# EAGLE design rpi0smiLS (EAGLE 9.3.2)
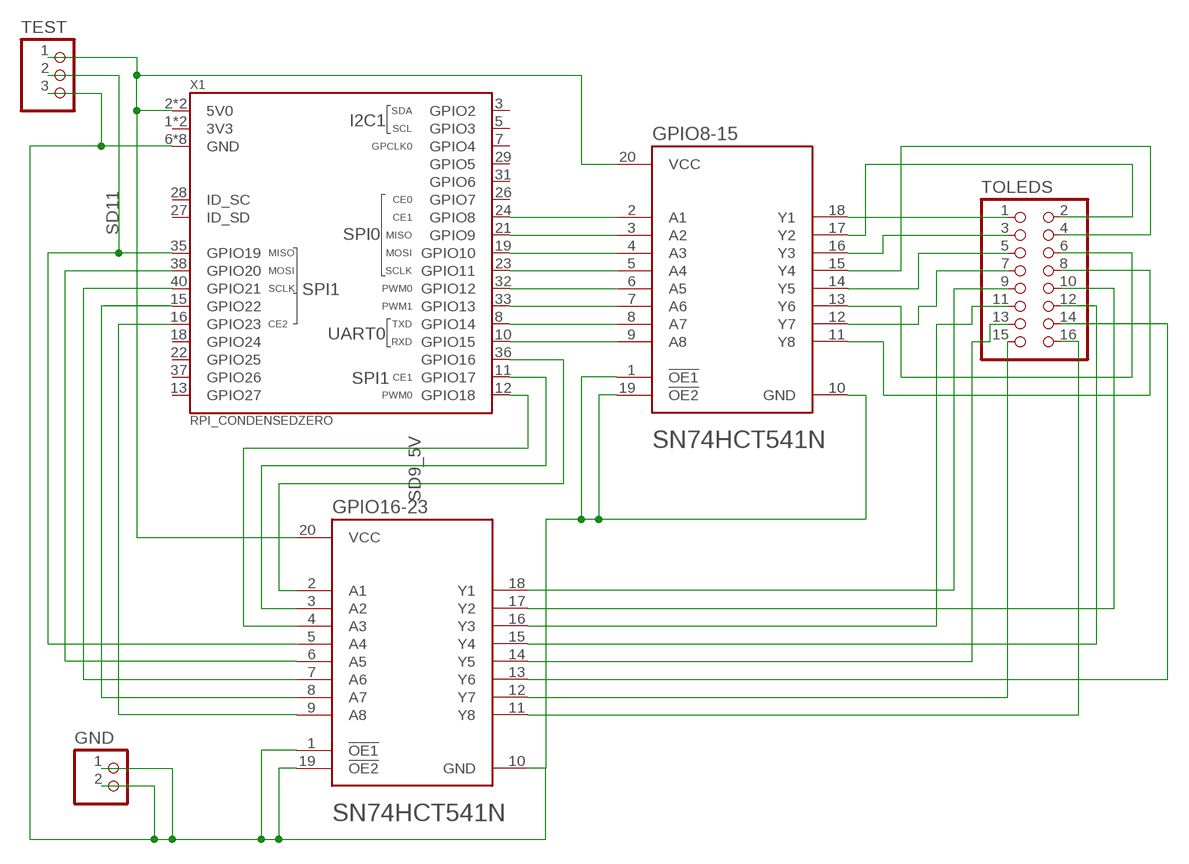
[diagram p0: schematic, sheet 1]

## Parts
GND  PINHD-1X2  [1X02]
GPIO8-15  TEXAS_INSTRUMENTS_SN74HCT541NTEXAS_INSTRUMENTS_SN74HCT541N_0_0  [TEXAS_INSTRUMENTS_SN74HCT541N_0]
GPIO16-23  TEXAS_INSTRUMENTS_SN74HCT541NTEXAS_INSTRUMENTS_SN74HCT541N_0_0  [TEXAS_INSTRUMENTS_SN74HCT541N_0]
TEST  PINHD-1X3  [1X03]
TOLEDS  PINHD-2X8  [2X08]
X1  RPI_CONDENSEDZERO  [RPI_ZERO_THT]

## Nets
GND: GND.1 GND.2 GPIO8-15.1(!OE1!) GPIO8-15.10(GND) GPIO8-15.19(!OE2!) GPIO16-23.1(!OE1!) GPIO16-23.10(GND) GPIO16-23.19(!OE2!) TEST.3 X1.6(GND) X1.9(GND) X1.14(GND) X1.20(GND) X1.25(GND) X1.30(GND) X1.34(GND) X1.39(GND)
PWR: GPIO8-15.20(VCC) GPIO16-23.20(VCC) TEST.1 X1.2(5V0) X1.4(5V0)
SD0: GPIO8-15.2(A1) X1.24(GPIO8)
SD0_5V: GPIO8-15.18(Y1) TOLEDS.1
SD1: GPIO8-15.3(A2) X1.21(GPIO9)
SD1_5V: GPIO8-15.17(Y2) TOLEDS.2
SD2: GPIO8-15.4(A3) X1.19(GPIO10)
SD2_5V: GPIO8-15.16(Y3) TOLEDS.3
SD3: GPIO8-15.5(A4) X1.23(GPIO11)
SD3_5V: GPIO8-15.15(Y4) TOLEDS.4
SD4: GPIO8-15.6(A5) X1.32(GPIO12)
SD4_5V: GPIO8-15.14(Y5) TOLEDS.5
SD5: GPIO8-15.7(A6) X1.33(GPIO13)
SD5_5V: GPIO8-15.13(Y6) TOLEDS.6
SD6: GPIO8-15.8(A7) X1.8(GPIO14)
SD6_5V: GPIO8-15.12(Y7) TOLEDS.7
SD7: GPIO8-15.9(A8) X1.10(GPIO15)
SD7_5V: GPIO8-15.11(Y8) TOLEDS.8
SD8: GPIO16-23.2(A1) X1.36(GPIO16)
SD8_5V: GPIO16-23.18(Y1) TOLEDS.9
SD9: GPIO16-23.3(A2) X1.11(GPIO17)
SD9_5V: GPIO16-23.17(Y2) TOLEDS.10
SD10: GPIO16-23.4(A3) X1.12(GPIO18)
SD11: GPIO16-23.5(A4) TEST.2 X1.35(GPIO19)
SD11_5V: GPIO16-23.15(Y4) TOLEDS.12
SD12: GPIO16-23.6(A5) X1.38(GPIO20)
SD12_5V: GPIO16-23.14(Y5) TOLEDS.13
SD13: GPIO16-23.7(A6) X1.40(GPIO21)
SD13_5V: GPIO16-23.13(Y6) TOLEDS.14
SD14: GPIO16-23.8(A7) X1.15(GPIO22)
SD14_5V: GPIO16-23.12(Y7) TOLEDS.15
SD15: GPIO16-23.9(A8) X1.16(GPIO23)
SD15_5V: GPIO16-23.11(Y8) TOLEDS.16
SD_10_5V: GPIO16-23.16(Y3) TOLEDS.11
Unconnected: X1.3(GPIO2) X1.5(GPIO3) X1.7(GPIO4) X1.13(GPIO27) X1.18(GPIO24) X1.22(GPIO25) X1.26(GPIO7) X1.27(ID_SD) X1.28(ID_SC) X1.29(GPIO5) X1.31(GPIO6) X1.37(GPIO26)

## Power pins joined to a net without a drawn wire
3V3: X1.1(3V3) X1.17(3V3)

## Library data of the parts
GND = pinhead:PINHD-1X2: PIN HEADER
GPIO8-15 GPIO16-23 = Texas Instruments - SN74HCT541N:TEXAS_INSTRUMENTS_SN74HCT541N: Buffer, Non-Inverting 1 Element 8 Bit per Element 3-State Output 20-PDIP; AMBIENT_TEMPERATURE_RANGE_HIGH: +85°C; AMBIENT_TEMPERATURE_RANGE_LOW: -40°C; AUTOMOTIVE: No; CENTROID_NOT_SPECIFIED: No; DATASHEET: http://www-s.ti.com/sc/ds/sn74hct541.pdf; DEVICE_CLASS_L1: Integrated Circuits (ICs); DEVICE_CLASS_L2: Logic ICs; DEVICE_CLASS_L3: Buffers; DIGIKEY_DESCRIPTION: IC BUF NON-INVERT 5.5V 20DIP; DIGIKEY_PART_NUMBER: 296-1619-5-ND; FOOTPRINT_PARAMETERS_0: {"fp_type":"DIP","params":{"N":{"nom":20,"long name":"Number of leads","min":null,"max":null,"short name":"N","type":"count"},"A":{"nom":false,"long name":"Height","min":false,"max":5080000,"short name":"A","type":"measurement"},"A1":{"nom":false,"long name":"Package clearance","min":510000,"max":false,"short name":"A1","type":"measurement"},"A2":{"nom":false,"long name":"Package height","min":false,"max":4570000,"short name":"A2","type":"measurement"},"D":{"nom":25400000,"long name":"Package length","min":23880000,"max":26920000,"short name":"D","type":"measurement"},"E":{"nom":7940000,"long name":"Width w/ leads","min":7620000,"max":8260000,"short name":"E","type":"measurement"},"E1":{"nom":6350000,"long name":"Package width","min":6100000,"max":6600000,"short name":"E1","type":"measurement"},"B":{"nom":455000,"long name":"Lead width","min":380000,"max":530000,"short name":"B","type":"measurement"},"C":{"nom":250000,"long name":"Lead thickness","min":false,"max":false,"short name":"C","type":"measurement"},"e":{"nom":2540000,"long name":"Lead pitch","min":null,"max":null,"short name":"e","type":"measurement"},"offset x":{"nom":0,"long name":"X Center offset","min":null,"max":null,"short name":"offset x","type":"measurement"},"offset y":{"nom":0,"long name":"Y Center offset","min":null,"max":null,"short name":"offset y","type":"measurement"},"LS":{"default":"Circle","long name":"Land shape","type":"multichoice","short name":"LS"},"LS1":{"default":"Square","long name":"Land shape (Pin 1)","type":"multichoice","short name":"LS1"}}}; FOOTPRINT_VARIANT_NAME_0: Recommended_Land_Pattern; HEIGHT: 5.08mm; LEAD_FREE: Yes; LOGIC_FUNCTION_DESC: Non-Inverting; MAX_SUPPLY_VOLTAGE: 5.5V; MF: Texas Instruments; MFG_PACKAGE_IDENT: N0020A; MFG_PACKAGE_IDENT_COMPONENT_ID: 19cf7ba8c238dfd4; MFG_PACKAGE_IDENT_DATE: 0; MFG_PACKAGE_IDENT_REV: 0; MIN_SUPPLY_VOLTAGE: 4.5V; MOUSER_DESCRIPTION: Buffers & Line Drivers Octal Buffer/Line; MOUSER_PART_NUMBER: 595-SN74HCT541N; MPN: SN74HCT541N; NOMINAL_SUPPLY_CURRENT: 80uA; NUMBER_OF_CIRCUITS: 1; NUMBER_OF_INPUTS: 8; NUMBER_OF_OUTPUTS: 8; PACKAGE: PDIP20; PREFIX: U; PROPAGATION_DELAY: 19ns; ROHS: Yes; STANDOFF_HEIGHT: 0.51mm; TEMPERATURE_RANGE_HIGH: +85°C; TEMPERATURE_RANGE_LOW: -40°C; VERIFICATION_VERSION: 0.0.0.3
TEST = pinhead:PINHD-1X3: PIN HEADER
TOLEDS = pinhead:PINHD-2X8: PIN HEADER
X1 = rpi_hat:RPI_CONDENSED

## Board
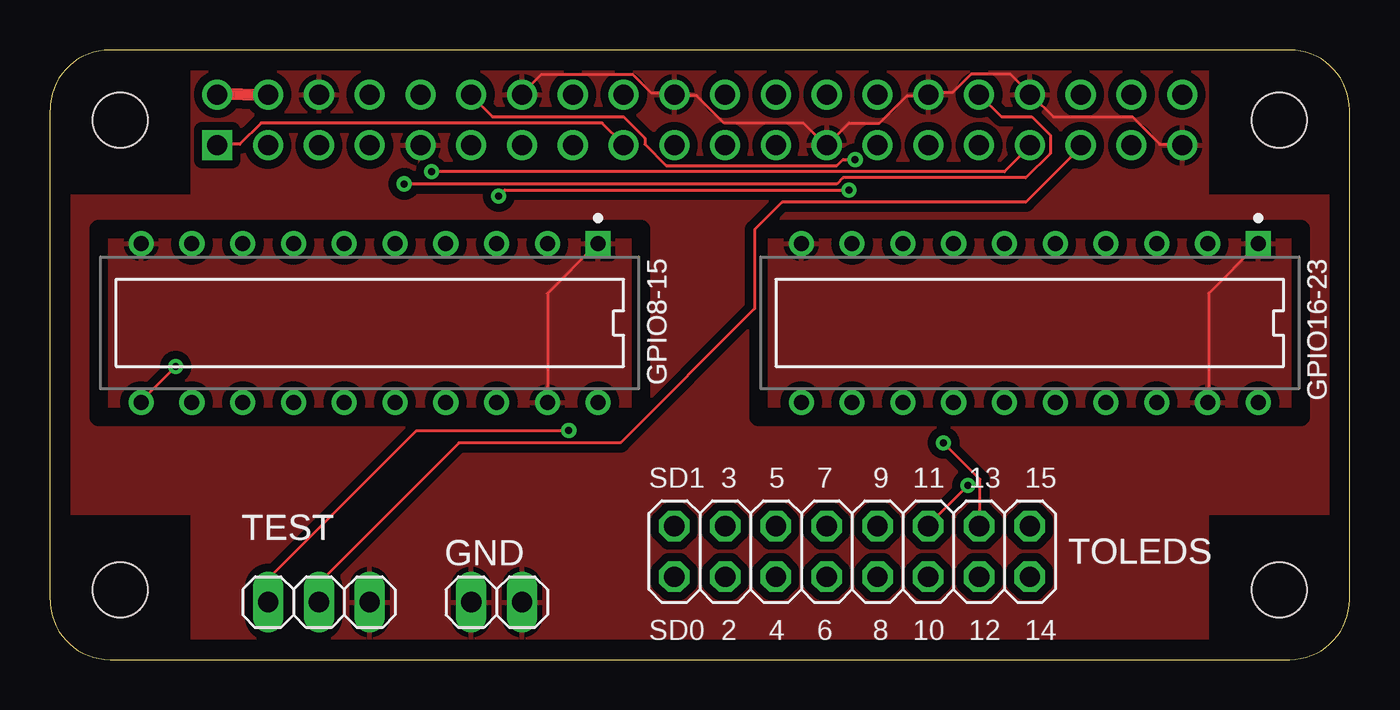
[diagram p1: board, top side]
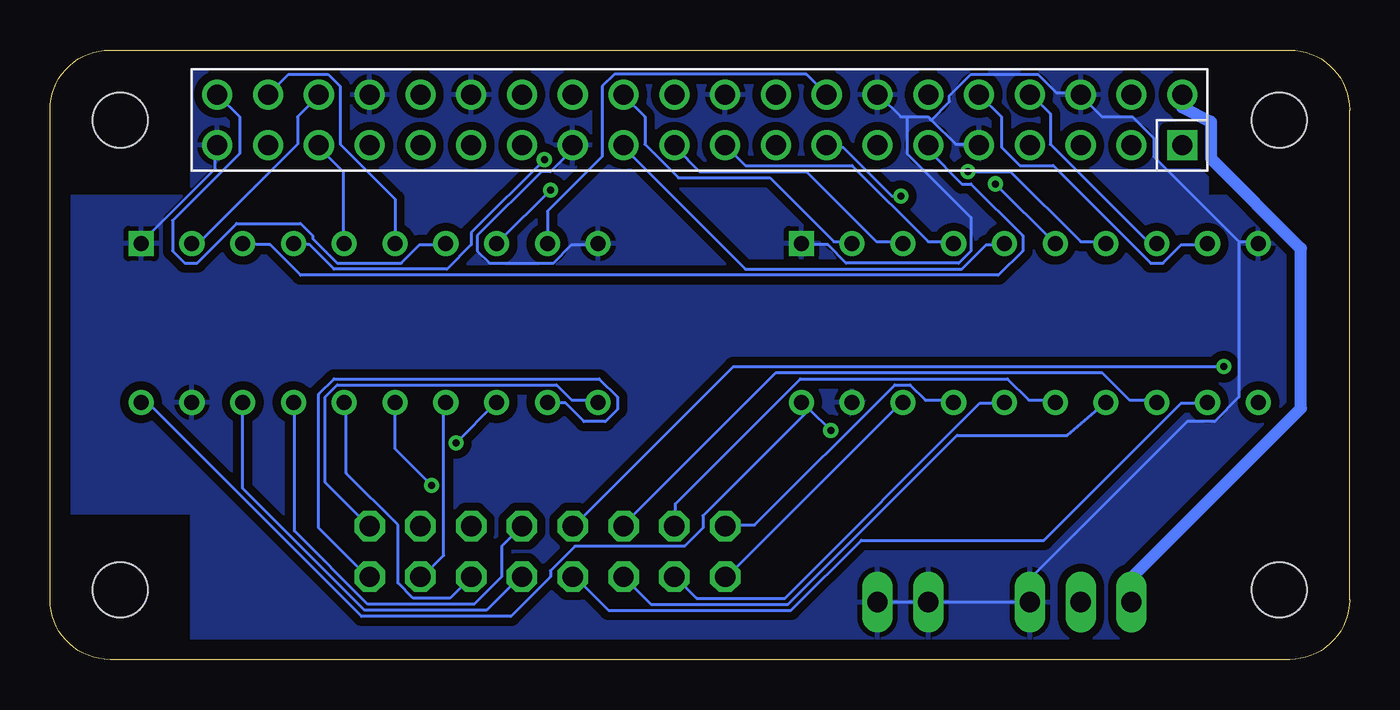
[diagram p2: board, bottom side, seen from below]

Size 65 x 30.5 mm. Coordinates in mm from the lower left corner, seen from the top.
Copper layers (1*16): Top 0.035mm / dielectric 1.5mm / Bottom 0.035mm
Design rules "default": minimum track width 6mil, minimum drill 0.35mm, track to track 6mil, track to pad 6mil, pad to pad 6mil, via to via 6mil, smd to smd 6mil, copper to edge 40mil, drill to drill 6mil, minimum pad ring 10mil, minimum via ring 8mil, stop-mask expansion 4mil, vias tented up to drill 0mil, thermal gap 10mil

### Footprints (pad centres in the part's own frame; a part is rotated, then mirrored left to right if it is on the bottom)
1X02 = drill 1.016 long: 1 -1.27,0; 2 1.27,0
TEXAS_INSTRUMENTS_SN74HCT541N_0 = drill 0.75 pad 1.25 square: 1 -3.97,11.43 | drill 0.75 pad 1.25: 2 -3.97,8.89; 3 -3.97,6.35; 4 -3.97,3.81; 5 -3.97,1.27; 6 -3.97,-1.27; 7 -3.97,-3.81; 8 -3.97,-6.35; 9 -3.97,-8.89; 10 -3.97,-11.43; 11 3.97,-11.43; 12 3.97,-8.89; 13 3.97,-6.35; 14 3.97,-3.81; 15 3.97,-1.27; 16 3.97,1.27; 17 3.97,3.81; 18 3.97,6.35; 19 3.97,8.89; 20 3.97,11.43
1X03 = drill 1.016 long: 1 -2.54,0; 2 0,0; 3 2.54,0
2X08 = drill 1.016 octagon: 1 -8.89,-1.27; 2 -8.89,1.27; 3 -6.35,-1.27; 4 -6.35,1.27; 5 -3.81,-1.27; 6 -3.81,1.27; 7 -1.27,-1.27; 8 -1.27,1.27; 9 1.27,-1.27; 10 1.27,1.27; 11 3.81,-1.27; 12 3.81,1.27; 13 6.35,-1.27; 14 6.35,1.27; 15 8.89,-1.27; 16 8.89,1.27
RPI_ZERO_THT = drill 1 square: 1 -24.13,-1.27 | drill 1: 2 -24.13,1.27; 3 -21.59,-1.27; 4 -21.59,1.27; 5 -19.05,-1.27; 6 -19.05,1.27; 7 -16.51,-1.27; 8 -16.51,1.27; 9 -13.97,-1.27; 10 -13.97,1.27; 11 -11.43,-1.27; 12 -11.43,1.27; 13 -8.89,-1.27; 14 -8.89,1.27; 15 -6.35,-1.27; 16 -6.35,1.27; 17 -3.81,-1.27; 18 -3.81,1.27; 19 -1.27,-1.27; 20 -1.27,1.27; 21 1.27,-1.27; 22 1.27,1.27; 23 3.81,-1.27; 24 3.81,1.27; 25 6.35,-1.27; 26 6.35,1.27; 27 8.89,-1.27; 28 8.89,1.27; 29 11.43,-1.27; 30 11.43,1.27; 31 13.97,-1.27; 32 13.97,1.27; 33 16.51,-1.27; 34 16.51,1.27; 35 19.05,-1.27; 36 19.05,1.27; 37 21.59,-1.27; 38 21.59,1.27; 39 24.13,-1.27; 40 24.13,1.27 | hole 2.75: -29,0; -29,-23.5; 29,0; 29,-23.5

### Placement (x,y rotation side)
GND  22.34,2.87 0 top
GPIO8-15  15.99,16.84 270 top
GPIO16-23  49.01,16.84 270 top
TEST  13.45,2.87 0 top
TOLEDS  40.12,5.41 0 top
X1  32.5,27 0 top

### Tracks (layer width: path | path; a pad name or v marks a point on that pad's centre or on a via)
3V3
  Top 0.152: X1.1 8.42,25.78 9.49,25.78 10.55,26.85 27.62,26.85 28.69,25.78 X1.17
GND
  Top 0.152: GPIO8-15.19 24.88,18.31 27.32,20.75 GPIO8-15.1 | X1.14 23.66,28.37 24.57,29.29 29.15,29.29 30.06,28.37 31.13,28.37 X1.20 31.28,28.22 32.35,28.22 33.72,26.85 37.68,26.85 38.75,25.78 X1.25 39.97,26.85 41.49,26.85 42.86,28.22 43.93,28.22 X1.30 43.93,28.37 45.15,28.37 46.06,29.29 48.05,29.29 48.96,28.37 X1.34 49.11,28.22 50.18,27.15 54.14,27.15 55.51,25.78 56.58,25.78 X1.39 | GPIO16-23.19 57.95,12.98 57.95,18.31 60.39,20.75 GPIO16-23.1
  Bottom 0.152: 5.52,20.9 4.61,20.9 GPIO8-15.10 | 5.52,20.9 9.79,25.17 9.79,26.09 10.86,27.15 12.38,27.15 13.45,28.22 X1.6 13.45,28.37 14.67,28.37 15.58,29.29 18.94,29.29 20,28.22 20,27.91 20.92,27 | 5.52,20.9 5.52,13.13 6.74,11.91 8.12,11.91 15.99,4.04 TEST.3 GND.1 GND.2 | 20.92,27 21.07,27.15 22.14,27.15 | 20.92,27 19.7,25.78 18.63,25.78 X1.9 | 22.14,27.15 22.44,27.15 23.51,28.22 X1.14 | 22.14,27.15 22.14,25.32 18.94,22.12 18.94,20.45 19.55,19.84 25.18,19.84 26.1,20.75 27.32,20.75 GPIO8-15.1 | X1.39 56.73,25.63 56.73,24.56 60.39,20.9 GPIO16-23.1 | GPIO16-23.10 37.68,20.75 38.9,20.75 39.81,19.84 43.02,19.84 43.62,20.45 43.62,21.21 40.42,24.41 39.97,24.41 38.75,25.63 X1.25
  pour Top (isolate 0.406): 7.1,30.18 7.1,23.19 0.75,23.19 0.75,7.31 7.1,7.31 7.1,0.96 57.9,0.96 57.9,7.31 64.25,7.31 64.25,23.19 57.9,23.19 57.9,30.18
  pour Bottom (isolate 0.406): 0.75,23.19 0.75,7.31 7.1,7.31 7.1,0.96 57.9,0.96 57.9,7.31 64.25,7.31 64.25,23.19 57.9,23.19 57.9,29.54 7.1,29.54 7.1,23.19
PWR  (via drill 0.35)
  Top 0.152: 8.42,28.32 X1.2 | 10.86,28.22 X1.4 | v25.95,11.46 18.33,11.46 10.91,4.04 TEST.1
  Top 0.61: 10.86,28.22 8.42,28.32
  Bottom 0.152: v25.95,11.46 27.01,12.52 | 27.01,12.52 27.32,12.83 GPIO8-15.20 27.01,12.52 | 27.01,12.52 32.35,7.19 32.35,6.58 33.26,5.66 38.75,5.66 39.97,4.44 39.97,4.14 41.95,2.16 49.42,2.16 60.08,12.83 60.39,12.83 GPIO16-23.20
  Bottom 0.61: X1.2 8.37,27.63 6.95,26.92 6.92,26.9 6.92,25.07 2.43,20.57 2.43,12.57 10.91,4.09 TEST.1
SD0
  Bottom 0.152: GPIO8-15.2 24.88,20.9 25.79,20.9 28.99,24.1 33.57,24.1 35.24,25.78 35.24,27.15 36.31,28.22 X1.24
SD0_5V
  Bottom 0.152: GPIO8-15.18 22.44,12.83 31.13,4.14 TOLEDS.1
SD1
  Bottom 0.152: GPIO8-15.3 22.44,20.9 23.66,20.9 27.17,24.41 32.5,24.41 33.72,25.63 X1.21
SD1_5V
  Bottom 0.152: GPIO8-15.17 19.85,12.98 21.22,12.98 21.98,13.74 22.75,13.74 29.76,6.73 31.13,6.73 TOLEDS.2
SD2
  Bottom 0.152: X1.19 30.21,24.71 24.88,24.71 21.07,20.9 19.85,20.9 GPIO8-15.4
SD2_5V
  Bottom 0.152: GPIO8-15.16 17.26,12.83 18.48,12.83 28.23,3.07 32.65,3.07 33.72,4.14 TOLEDS.3
SD3
  Bottom 0.152: GPIO8-15.5 17.26,20.75 18.17,20.75 19.39,19.53 30.21,19.53 36.31,25.63 X1.23
SD3_5V
  Bottom 0.152: GPIO8-15.15 14.82,12.98 16.04,12.98 17.11,14.05 27.47,14.05 33.72,7.8 33.72,6.73 TOLEDS.4
SD4  (via drill 0.35)
  Top 0.152: v17.72,23.8 39.36,23.8 39.66,24.1 48.81,24.1 50.03,25.32 50.03,26.24 49.11,27.15 47.59,27.15 X1.32
  Bottom 0.152: v17.72,23.8 14.82,20.9 GPIO8-15.6
SD4_5V
  Bottom 0.152: TOLEDS.5 34.94,2.77 28.08,2.77 19.63,11.22 14.12,11.22 GPIO8-15.14
SD5  (via drill 0.35)
  Top 0.152: v19.09,24.41 47.74,24.41 48.96,25.63 X1.33
  Bottom 0.152: v19.09,24.41 16.95,24.41 13.45,20.9 12.23,20.9 GPIO8-15.7
SD5_5V
  Bottom 0.152: GPIO8-15.13 9.64,12.98 11.01,12.98 12.38,14.35 28.69,14.35 36.31,6.73 TOLEDS.6
SD6
  Bottom 0.152: GPIO8-15.8 9.64,20.9 10.1,20.9 14.97,25.78 14.97,27.3 15.89,28.22 X1.8
SD6_5V
  Bottom 0.152: GPIO8-15.12 7.2,12.83 8.42,12.83 15.28,5.97 24.42,5.97 27.93,2.46 37.07,2.46 38.75,4.14 TOLEDS.7
SD7
  Bottom 0.152: X1.10 17.41,27.15 17.41,25.63 16.5,24.71 14.82,24.71 9.94,19.84 9.33,19.84 8.42,20.75 7.2,20.75 GPIO8-15.9
SD7_5V  (via drill 0.35)
  Top 0.152: v6.29,14.66 4.61,12.98 GPIO8-15.11
  Bottom 0.152: v6.29,14.66 30.82,14.66 38.75,6.73 TOLEDS.8
SD8
  Bottom 0.152: GPIO16-23.2 57.8,20.9 57.49,20.9 52.62,25.78 52.62,27.15 51.55,28.22 X1.36
SD8_5V
  Bottom 0.152: GPIO16-23.18 55.36,8.56 49.26,2.46 43.17,2.46 41.49,4.14 TOLEDS.9
SD9
  Bottom 0.152: X1.11 21.07,25.48 19.39,23.8 18.94,23.8 16.35,21.21 16.35,20.45 17.56,19.23 52.46,19.23 53.99,20.75 55.36,20.75 GPIO16-23.3
SD9_5V
  Bottom 0.152: TOLEDS.10 42.41,5.66 42.41,4.14 43.78,2.77 49.11,2.77 52.77,6.43 52.77,12.83 GPIO16-23.17
SD10  (via drill 0.35)
  Top 0.152: v40.27,25.02 39.66,25.02 39.36,24.71 30.82,24.71 29.76,25.78 29.76,26.09 28.69,27.15 22.14,27.15 21.07,28.22 X1.12
  Bottom 0.152: v40.27,25.02 43.93,21.36 43.93,20.75 45.15,19.53 50.79,19.53 52.01,20.75 52.77,20.75 GPIO16-23.4
SD11
  Top 0.152: TEST.2 13.45,3.83 20.46,10.85 28.54,10.85 35.24,17.55 35.24,21.51 36.62,22.88 48.81,22.88 51.55,25.63 X1.35
  Bottom 0.152: GPIO16-23.5 50.33,20.9 50.33,24.41 51.55,25.63 X1.35
SD11_5V  (via drill 0.35)
  Top 0.152: v45.91,8.71 43.93,6.73 TOLEDS.12
  Bottom 0.152: GPIO16-23.15 47.74,10.54 v45.91,8.71
SD12
  Bottom 0.152: GPIO16-23.6 47.74,23.04 50.48,25.78 50.48,28.68 51.09,29.29 53.07,29.29 X1.38
SD12_5V
  Bottom 0.152: GPIO16-23.14 45.3,12.83 45.3,5.21 46.37,4.14 TOLEDS.13
SD13
  Bottom 0.152: X1.40 55.51,27.15 55.51,25.32 58.87,21.97 58.87,20.45 58.26,19.84 57.65,19.84 55.66,21.82 52.46,21.82 51.85,21.21 51.85,21.06 50.64,19.84 47.43,19.84 46.52,20.75 45.3,20.75 GPIO16-23.7
SD13_5V  (via drill 0.35)
  Top 0.152: v44.69,10.85 46.52,9.02 46.52,6.73 TOLEDS.14
  Bottom 0.152: v44.69,10.85 42.71,12.83 GPIO16-23.13
SD14  (via drill 0.35)
  Top 0.152: v39.97,23.5 22.75,23.5 v22.44,23.19
  Bottom 0.152: v39.97,23.5 42.56,20.9 GPIO16-23.8 | v22.44,23.19 22.9,23.19 25.34,25.63 26.1,25.63 X1.15
SD14_5V
  Bottom 0.152: GPIO16-23.12 40.12,12.83 39.21,12.83 38.29,11.91 37.22,11.91 36.62,12.52 36.62,13.13 37.53,14.05 50.79,14.05 51.55,13.28 51.55,6.58 49.11,4.14 TOLEDS.15
SD15
  Bottom 0.152: GPIO16-23.9 40.12,22.43 37.38,25.17 37.38,28.68 36.77,29.29 27.17,29.29 X1.16
SD15_5V
  Bottom 0.152: GPIO16-23.11 37.68,12.98 38.9,12.98 39.66,13.74 50.64,13.74 51.24,13.13 51.24,8.86 49.11,6.73 TOLEDS.16
SD_10_5V
  Bottom 0.152: TOLEDS.11 45,3.07 46.83,3.07 47.59,3.83 47.59,6.73 50.18,9.32 50.18,12.83 GPIO16-23.16

### Text on the board
tPlace: SD1 3 5 7 9 11 13 15 | SD0 2 4 6 8 10 12 14
_tNames: GPIO8-15 | GPIO16-23 | TEST | GND | TOLEDS